# Altium schematic sheet S7CAS-PLEIADES-CARTE-MERE_P20_Flash-Sensors-FPGA-bank-2.SchDoc
size Tabloid; SheetNumber: 8; SheetTotal: 20; Sheet_Name: Flash Sensors FPGA Bank 2; Size: 11x17
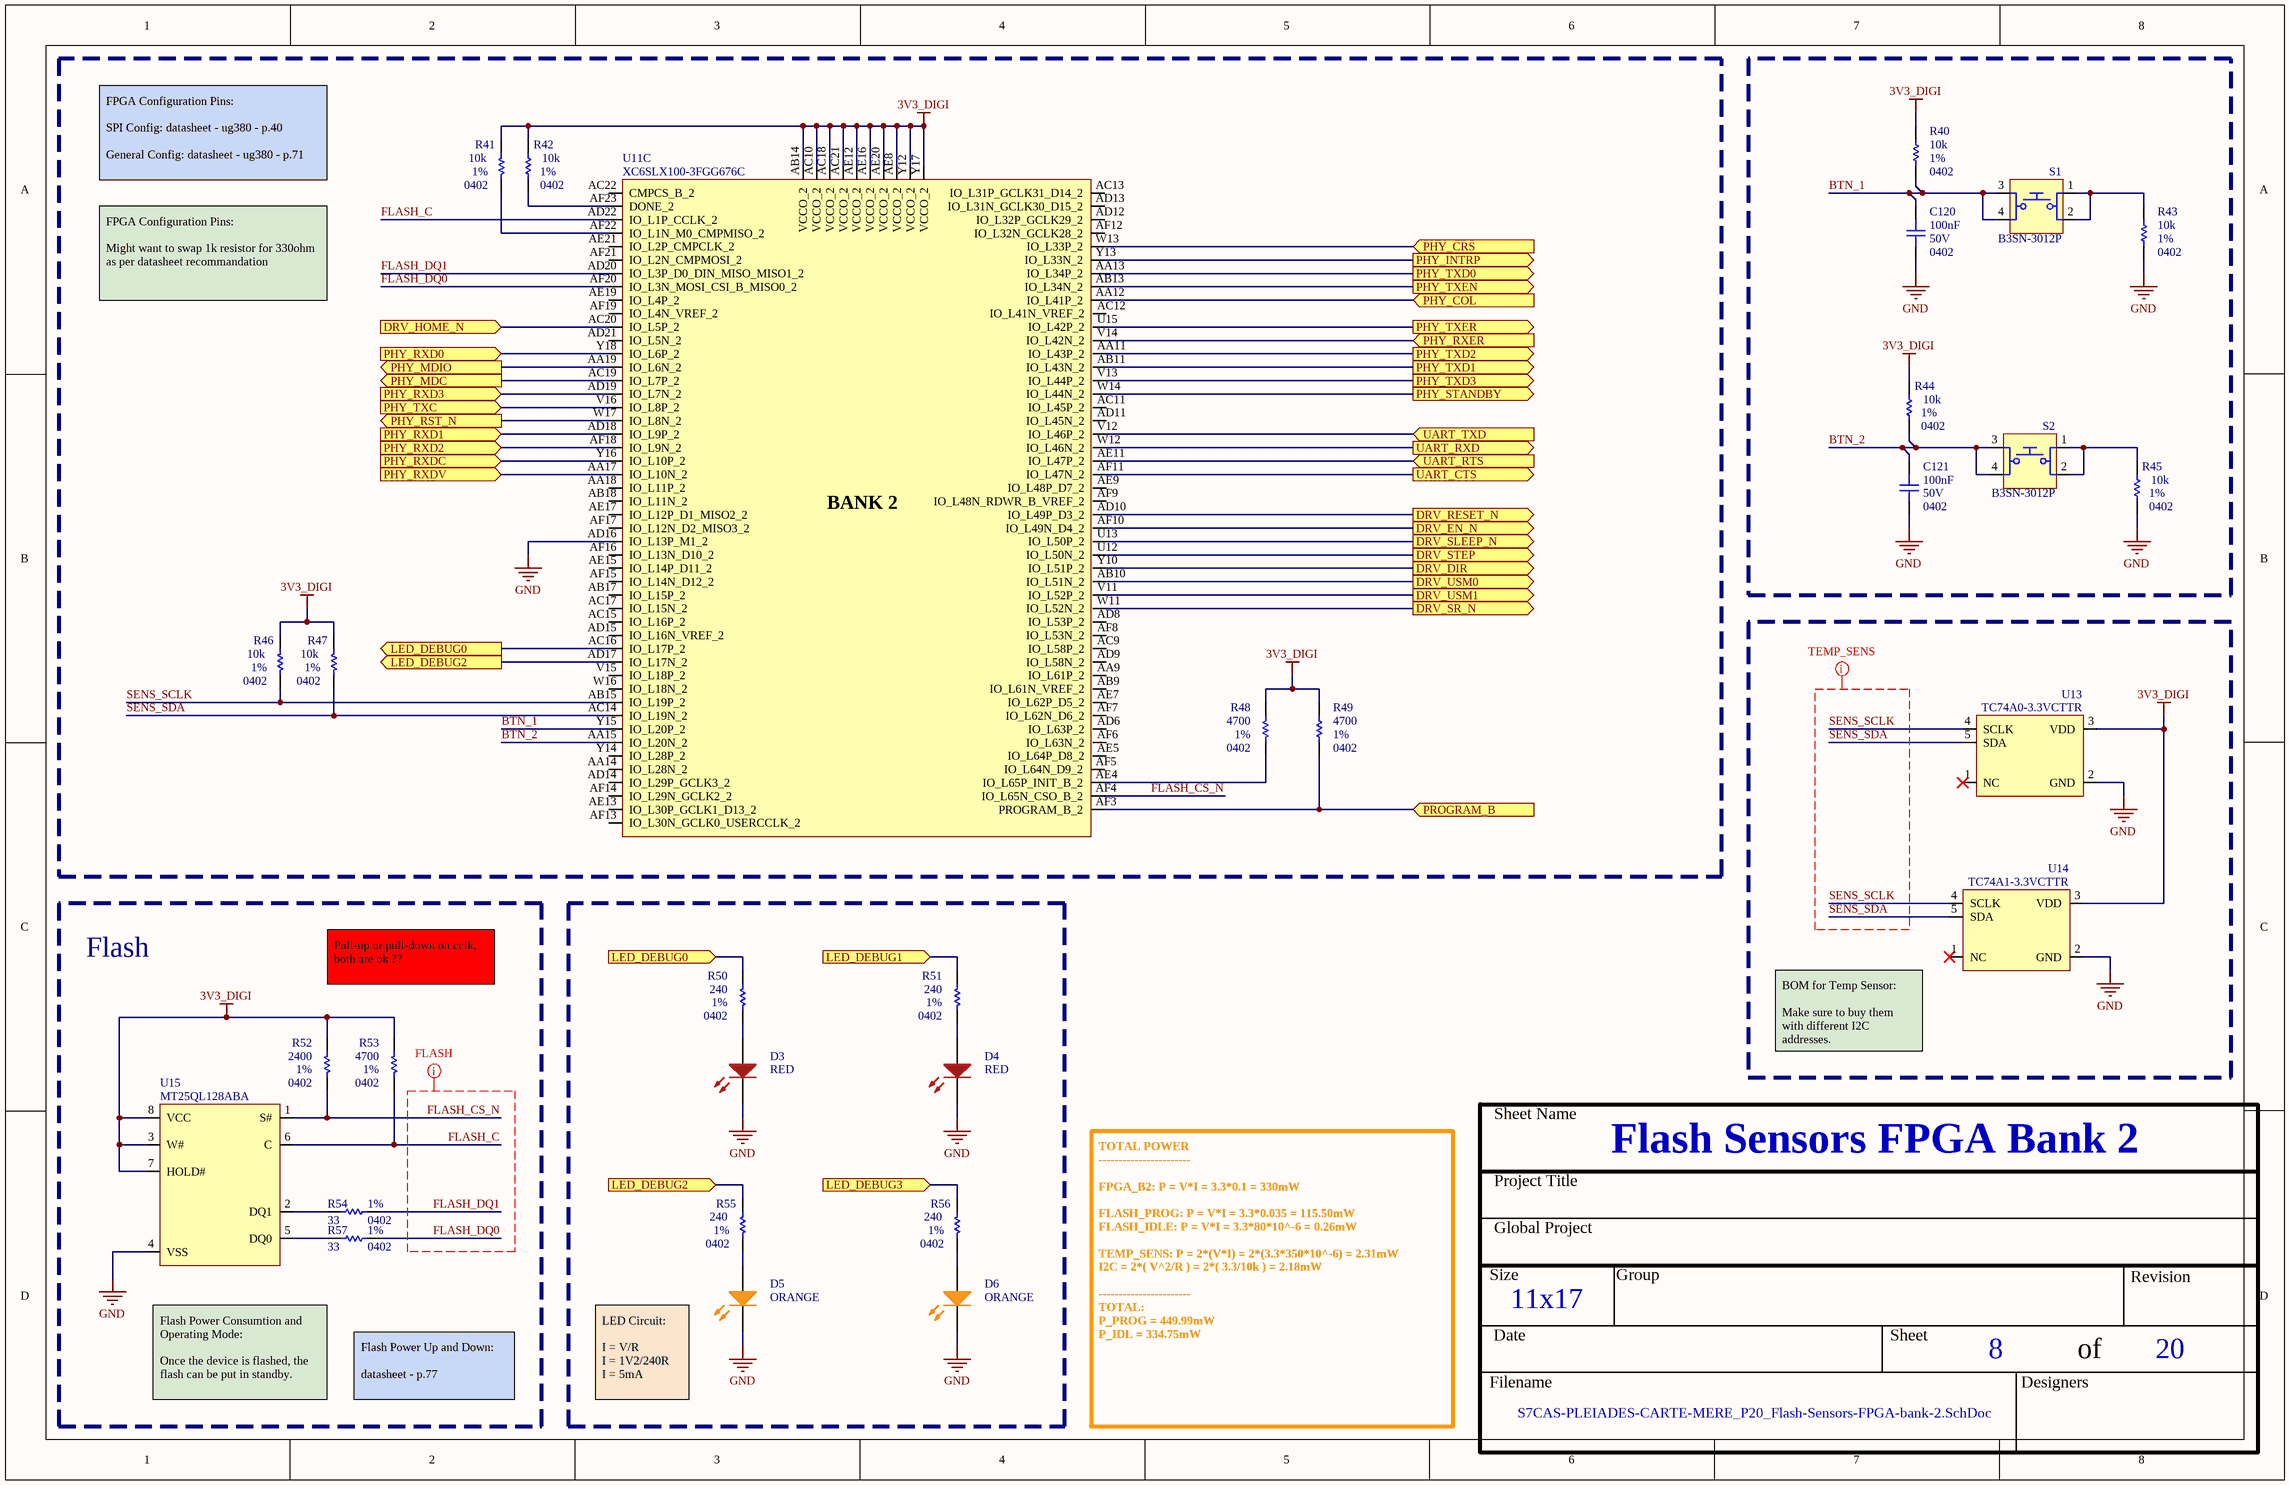
[diagram p0: S7CAS-PLEIADES-CARTE-MERE_P20_Flash-Sensors-FPGA-bank-2.SchDoc]

## Parts
C120  value 100nF  Voltage: 50V  Package: 0402  [CAP_0402]  (hidden comment: CAP - 0402)
C121  value 100nF  Voltage: 50V  Package: 0402  [CAP_0402]  (hidden comment: CAP - 0402)
D3  value RED  [LED_0603]  (hidden comment: SML-311UTT86)
D4  value RED  [LED_0603]  (hidden comment: SML-311UTT86)
D5  value ORANGE  [LED_0603]  (hidden comment: SML-311DTT86)
D6  value ORANGE  [LED_0603]  (hidden comment: SML-311DTT86)
R40  value 10k  Package: 0402  Precision: 1%  [RES_0402]  (hidden comment: RES - 0402)
R41  value 10k  Package: 0402  Precision: 1%  [RES_0402]  (hidden comment: RES - 0402)
R42  value 10k  Package: 0402  Precision: 1%  [RES_0402]  (hidden comment: RES - 0402)
R43  value 10k  Package: 0402  Precision: 1%  [RES_0402]  (hidden comment: RES - 0402)
R44  value 10k  Package: 0402  Precision: 1%  [RES_0402]  (hidden comment: RES - 0402)
R45  value 10k  Package: 0402  Precision: 1%  [RES_0402]  (hidden comment: RES - 0402)
R46  value 10k  Package: 0402  Precision: 1%  [RES_0402]  (hidden comment: RES - 0402)
R47  value 10k  Package: 0402  Precision: 1%  [RES_0402]  (hidden comment: RES - 0402)
R48  value 4700  Package: 0402  Precision: 1%  [RES_0402]  (hidden comment: RES - 0402)
R49  value 4700  Package: 0402  Precision: 1%  [RES_0402]  (hidden comment: RES - 0402)
R50  value 240  Package: 0402  Precision: 1%  [RES_0402]  (hidden comment: RES - 0402)
R51  value 240  Package: 0402  Precision: 1%  [RES_0402]  (hidden comment: RES - 0402)
R52  value 2400  Package: 0402  Precision: 1%  [RES_0402]  (hidden comment: RES - 0402)
R53  value 4700  Package: 0402  Precision: 1%  [RES_0402]  (hidden comment: RES - 0402)
R54  value 33  Package: 0402  Precision: 1%  [RES_0402]  (hidden comment: RES - 0402)
R55  value 240  Package: 0402  Precision: 1%  [RES_0402]  (hidden comment: RES - 0402)
R56  value 240  Package: 0402  Precision: 1%  [RES_0402]  (hidden comment: RES - 0402)
R57  value 33  Package: 0402  Precision: 1%  [RES_0402]  (hidden comment: RES - 0402)
S1  B3SN-3012P  [SWI_TACT_B3SN-3012P]
S2  B3SN-3012P  [SWI_TACT_B3SN-3012P]
U11  XC6SLX100-3FGG676C  [FPGA_XILINX_FGG676]  (part C of 10)
U13  TC74A0-3.3VCTTR  [SEN_TEMP_TC74A0-3.3VCTTR]
U14  TC74A1-3.3VCTTR  [SEN_TEMP_TC74A0-3.3VCTTR]
U15  MT25QL128ABA  [FLASH_MT25QL128ABA]

## Blocks framed on the sheet
Flash: R52-R54 R57 U15

## Ports
DRV_DIR (out), DRV_EN_N (out), DRV_HOME_N (in), DRV_RESET_N (out), DRV_SLEEP_N (out), DRV_SR_N (out), DRV_STEP (out), DRV_USM0 (out), DRV_USM1 (out), LED_DEBUG0 (in), LED_DEBUG0 (out), LED_DEBUG1 (in), LED_DEBUG2 (in), LED_DEBUG2 (out), LED_DEBUG3 (in), PHY_COL (in), PHY_CRS (in), PHY_INTRP (out), PHY_MDC (out), PHY_MDIO (out), PHY_RST_N (out), PHY_RXD0 (in), PHY_RXD1 (in), PHY_RXD2 (in), PHY_RXD3 (in), PHY_RXDC (in), PHY_RXDV (in), PHY_RXER (in), PHY_STANDBY (out), PHY_TXC (in), PHY_TXD0 (out), PHY_TXD1 (out), PHY_TXD2 (out), PHY_TXD3 (out), PHY_TXEN (out), PHY_TXER (out), PROGRAM_B (in), UART_CTS (out), UART_RTS (in), UART_RXD (out), UART_TXD (in)

## Nets
3V3_DIGI: R40.2 R41.2 R42.2 R44.2 R46.2 R47.2 R48.2 R49.2 R52.2 R53.2 U11.AB14(VCCO_2) U11.AC10(VCCO_2) U11.AC18(VCCO_2) U11.AC21(VCCO_2) U11.AE8(VCCO_2) U11.AE12(VCCO_2) U11.AE16(VCCO_2) U11.AE20(VCCO_2) U11.Y12(VCCO_2) U11.Y17(VCCO_2) U13.3(VDD) U14.3(VDD) U15.3(W#) U15.7(HOLD#) U15.8(VCC)
GND: C120.1 C121.1 D3.K D4.K D5.K D6.K R43.1 R45.1 U11.AD16(IO_L13P_M1_2) U13.2(GND) U14.2(GND) U15.4(VSS)
BTN_1: C120.2 R40.1 S1.3 S1.4 U11.Y15(IO_L20P_2)
BTN_2: C121.2 R44.1 S2.3 S2.4 U11.AA15(IO_L20N_2)
DRV_DIR: U11.Y10(IO_L51P_2) ; port DRV_DIR
DRV_EN_N: U11.AF10(IO_L49N_D4_2) ; port DRV_EN_N
DRV_HOME_N: U11.AC20(IO_L5P_2) ; port DRV_HOME_N
DRV_RESET_N: U11.AD10(IO_L49P_D3_2) ; port DRV_RESET_N
DRV_SLEEP_N: U11.U13(IO_L50P_2) ; port DRV_SLEEP_N
DRV_SR_N: U11.W11(IO_L52N_2) ; port DRV_SR_N
DRV_STEP: U11.U12(IO_L50N_2) ; port DRV_STEP
DRV_USM0: U11.AB10(IO_L51N_2) ; port DRV_USM0
DRV_USM1: U11.V11(IO_L52P_2) ; port DRV_USM1
FLASH_C: R53.1 U11.AD22(IO_L1P_CCLK_2) U15.6(C)
FLASH_CS_N: R52.1 U11.AF4(IO_L65N_CSO_B_2) U15.1(S#)
FLASH_DQ0: R57.1 U11.AF20(IO_L3N_MOSI_CSI_B_MISO0_2)
FLASH_DQ1: R54.1 U11.AD20(IO_L3P_D0_DIN_MISO_MISO1_2)
LED_DEBUG0: R50.2 U11.AC16(IO_L17P_2) ; port LED_DEBUG0
LED_DEBUG1: R51.2 ; port LED_DEBUG1
LED_DEBUG2: R55.2 U11.AD17(IO_L17N_2) ; port LED_DEBUG2
LED_DEBUG3: R56.2 ; port LED_DEBUG3
PHY_COL: U11.AA12(IO_L41P_2) ; port PHY_COL
PHY_CRS: U11.W13(IO_L33P_2) ; port PHY_CRS
PHY_INTRP: U11.Y13(IO_L33N_2) ; port PHY_INTRP
PHY_MDC: U11.AC19(IO_L7P_2) ; port PHY_MDC
PHY_MDIO: U11.AA19(IO_L6N_2) ; port PHY_MDIO
PHY_RST_N: U11.W17(IO_L8N_2) ; port PHY_RST_N
PHY_RXD0: U11.Y18(IO_L6P_2) ; port PHY_RXD0
PHY_RXD1: U11.AD18(IO_L9P_2) ; port PHY_RXD1
PHY_RXD2: U11.AF18(IO_L9N_2) ; port PHY_RXD2
PHY_RXD3: U11.AD19(IO_L7N_2) ; port PHY_RXD3
PHY_RXDC: U11.Y16(IO_L10P_2) ; port PHY_RXDC
PHY_RXDV: U11.AA17(IO_L10N_2) ; port PHY_RXDV
PHY_RXER: U11.V14(IO_L42N_2) ; port PHY_RXER
PHY_STANDBY: U11.W14(IO_L44N_2) ; port PHY_STANDBY
PHY_TXC: U11.V16(IO_L8P_2) ; port PHY_TXC
PHY_TXD0: U11.AA13(IO_L34P_2) ; port PHY_TXD0
PHY_TXD1: U11.AB11(IO_L43N_2) ; port PHY_TXD1
PHY_TXD2: U11.AA11(IO_L43P_2) ; port PHY_TXD2
PHY_TXD3: U11.V13(IO_L44P_2) ; port PHY_TXD3
PHY_TXEN: U11.AB13(IO_L34N_2) ; port PHY_TXEN
PHY_TXER: U11.U15(IO_L42P_2) ; port PHY_TXER
PROGRAM_B: R49.1 U11.AF3(PROGRAM_B_2) ; port PROGRAM_B
SENS_SCLK: R46.1 U11.AB15(IO_L19P_2) U13.4(SCLK) U14.4(SCLK)
SENS_SDA: R47.1 U11.AC14(IO_L19N_2) U13.5(SDA) U14.5(SDA)
UART_CTS: U11.AF11(IO_L47N_2) ; port UART_CTS
UART_RTS: U11.AE11(IO_L47P_2) ; port UART_RTS
UART_RXD: U11.W12(IO_L46N_2) ; port UART_RXD
UART_TXD: U11.V12(IO_L46P_2) ; port UART_TXD
NetD3_A: D3.A R50.1
NetD4_A: D4.A R51.1
NetD5_A: D5.A R55.1
NetD6_A: D6.A R56.1
NetR41_1: R41.1 U11.AF22(IO_L1N_M0_CMPMISO_2)
NetR42_1: R42.1 U11.AF23(DONE_2)
NetR43_2: R43.2 S1.1 S1.2
NetR45_2: R45.2 S2.1 S2.2
NetR48_1: R48.1 U11.AE4(IO_L65P_INIT_B_2)
NetR54_2: R54.2 U15.2(DQ1)
NetR57_2: R57.2 U15.5(DQ0)

Not connected (* = marked no-connect by the designer): U11 AA9(IO_L61P_2) AA14(IO_L28N_2) AA18(IO_L11P_2) AB9(IO_L61N_VREF_2) AB17(IO_L15P_2) AB18(IO_L11N_2) AC9(IO_L58P_2) AC11(IO_L45P_2) AC12(IO_L41N_VREF_2) AC13(IO_L31P_GCLK31_D14_2) AC15(IO_L16P_2) AC17(IO_L15N_2) AC22(CMPCS_B_2) AD6(IO_L63P_2) AD8(IO_L53P_2) AD9(IO_L58N_2) AD11(IO_L45N_2) AD12(IO_L32P_GCLK29_2) AD13(IO_L31N_GCLK30_D15_2) AD14(IO_L29P_GCLK3_2) AD15(IO_L16N_VREF_2) AD21(IO_L5N_2) AE5(IO_L64P_D8_2) AE7(IO_L62P_D5_2) AE9(IO_L48P_D7_2) AE13(IO_L30P_GCLK1_D13_2) AE15(IO_L14P_D11_2) AE17(IO_L12P_D1_MISO2_2) AE19(IO_L4P_2) AE21(IO_L2P_CMPCLK_2) AF5(IO_L64N_D9_2) AF6(IO_L63N_2) AF7(IO_L62N_D6_2) AF8(IO_L53N_2) AF9(IO_L48N_RDWR_B_VREF_2) AF12(IO_L32N_GCLK28_2) AF13(IO_L30N_GCLK0_USERCCLK_2) AF14(IO_L29N_GCLK2_2) AF15(IO_L14N_D12_2) AF16(IO_L13N_D10_2) AF17(IO_L12N_D2_MISO3_2) AF19(IO_L4N_VREF_2) AF21(IO_L2N_CMPMOSI_2) V15(IO_L18P_2) W16(IO_L18N_2) Y14(IO_L28P_2); U13 1(NC)*; U14 1(NC)*

## Layout directives
net class TRACKS_50: FLASH_C, FLASH_CS_N, FLASH_DQ0, FLASH_DQ1, SENS_SCLK, SENS_SDA

## Notes on the sheet
- FPGA Configuration Pins:
  SPI Config: datasheet - ug380 - p.40
  General Config: datasheet - ug380 - p.71
- FPGA Configuration Pins:
  Might want to swap 1k resistor for 330ohm as per datasheet recommandation
- Pull-up or pull-down on cclk, both are ok ??
- (near U14) BOM for Temp Sensor:
  Make sure to buy them with different I2C addresses.
- Flash Power Consumtion and Operating Mode:
  Once the device is flashed, the flash can be put in standby.
- Flash Power Up and Down:
  datasheet - p.77
- LED Circuit:
  I = V/R
  I = 1V2/240R
  I = 5mA
- TOTAL POWER
  -----------------------
  FPGA_B2: P = V*I = 3.3*0.1 = 330mW
  FLASH_PROG: P = V*I = 3.3*0.035 = 115.50mW
  FLASH_IDLE: P = V*I = 3.3*80*10^-6 = 0.26mW
  TEMP_SENS: P = 2*(V*I) = 2*(3.3*350*10^-6) = 2.31mW
  I2C = 2*( V^2/R ) = 2*( 3.3/10k ) = 2.18mW
  -----------------------
  TOTAL:
  P_PROG = 449.99mW
  P_IDL = 334.75mW
- Sheet Name
- Project Title
- Global Project
- Size
- Group
- Revision
- Date
- Sheet
- of
- Filename
- Designers
- (in symbol FPGA_XC6SLX100-3FGG676C, part C) BANK 2

## Library data of the parts
C120 C121 = CAP - 0402: Mfg Part Number: GRM155R61H104KE14; Precision: 10%; Current: *; CreatedBy: Jonathan Bouchard; Power: *
D3 D4 = LED_SML-311UTT86: LED - 620nM RED 2mA - 0603; Voltage: 1.8V; Mfg: ROHM Semiconductor; Power: 44mW; Current: 2mA; HelpURL: http://media.digikey.com/pdf/Data%20Sheets/Rohm%20PDFs/SML-311%20Series.pdf; CreatedBy: Jonathan Bouchard; Temperature: -30°C to 85°C; Package: 0603; Precision: *; Mfg Part Number: SML-311UTT86; Supplier 1: Digikey; Supplier Part Number 1: 511-1304-1-ND
D5 D6 = LED_SML-311DTT86: LED - 611nM ORANGE 2mA - 0603; Voltage: 1.8V; Mfg: ROHM Semiconductor; Power: 44mW; Current: 2mA; HelpURL: http://media.digikey.com/pdf/Data%20Sheets/Rohm%20PDFs/SML-311%20Series.pdf; CreatedBy: Jonathan Bouchard; Temperature: -40°C to 85°C; Package: 0603; Precision: *; Mfg Part Number: SML-311DTT86; Supplier 1: Digikey; Supplier Part Number 1: 511-1303-1-ND
R40-R47 = RES - 0402: Mfg Part Number: MCS04020C1002FE000; Voltage: 50V; Power: 1/16W; Current: *; CreatedBy: Jonathan Bouchard
R48 R49 R53 = RES - 0402: Mfg Part Number: TBD; Voltage: 50V; Power: 1/16W; Current: *; CreatedBy: Jonathan Bouchard
R50 R51 R55 R56 = RES - 0402: Mfg Part Number: ERA-2AEB241X; Voltage: 50V; Power: 1/2W; Current: *; CreatedBy: Jonathan Bouchard
R52 = RES - 0402: Voltage: 50V; Power: 1/16W; Current: *; CreatedBy: Jonathan Bouchard
R54 R57 = RES - 0402: Mfg Part Number: CRCW040233R0FKEDC; Voltage: 50V; Power: 1/16W; Current: *; CreatedBy: Jonathan Bouchard
S1 S2 = SWI_TACT_B3SN-3012P_1: SWI - SWITCH TACTILE SPST-NO 0.05A 24V -SMD; Manufacturer #1: Omron Electronics Inc-EMC Div; Current Rating: 50mA; Voltage rating: 24VDC; Polarized: No; Magnetic Material: UNKNOWN; GRAMS Lib Spec: 2.8; Manufacturer #2: *; Power Max: *; Value: SPST-NO; Part Number #1: B3SN-3012P; Part Number #2: *; HelpURL: http://omronfs.omron.com/en_US/ecb/products/pdf/en-b3sn.pdf; Supplier 1: Digi-Key; Supplier Part Number 1: SW261CT-ND; Assembly Type: SMD; Temperature: -25°C ~ 70°C; Package: SMD; CreatedBy/Date: Olivier Bernard / 5/12/2017; Tolerance: *; VerifiedBy: Caroline Paulin / 11 juillet 2018; Cryo: UNKNOWN; Mfg Part Number: B3SN-3012P
U11 = FPGA_XC6SLX100-3FGG676C: FPGA - XILINX SPARTAN 6 480 I/O - BGA-676; Voltage: 1.14 V ~ 1.26 V; Current: *; Power: *; Mfg: Xilinx; Mfg Part Number: XC6SLX100-3FGG676C; HelpURL: https://www.xilinx.com/support/documentation/data_sheets/ds162.pdf; CreatedBy: Jonathan Bouchard; Temperature: 0°C ~ 85°C (TJ); Value: *; Precision: *; Package: BGA-676; Supplier 1: Digikey; Supplier Part Number 1: 122-1760-ND
U13 U14 = SENS_TEMP_TC74A0-3.3VCTTR: SENS - TEMPERATURE SENSOR I2C/SMBUS - SOT23-5; Voltage: 2.7 V ~ 5.5 V; Mfg: Microchip; Precision: ±2°C (±3°C); Current: *; Power: *; Mfg Part Number: TC74A0-3.3VCTTR; HelpURL: http://ww1.microchip.com/downloads/en/DeviceDoc/21462D.pdf; CreatedBy: Jonathan Bouchard; Temperature: -40°C ~ 125°C; Value: *; Package: SOT23-5; Supplier 1: Digikey; Supplier Part Number 1: TC74A0-3.3VCTDKR-ND
U15 = FLASH_MT25QL128ABA: MT25QL128ABA - 128Mb, 3V Multiple I/O Serial Flash Memory - Package code : SE; Manufacturer #1: Micron; Voltage Rating: 2V7 - 3V6; GRAMS Lib Spec: 2.7; HelpURL: https://media-www.micron.com/-/media/client/global/documents/products/data-sheet/nor-flash/serial-nor/mt25q/die-rev-a/mt25q_qlhs_l_128_aba_0.pdf; Supplier 1: Digikey; Supplier Part Number 1: MT25QL128ABA1ESE-0SIT TR